# EasyEDA Pro project ProDoc_Small size safemrc_2025-09-04.epro, board PCB1_1
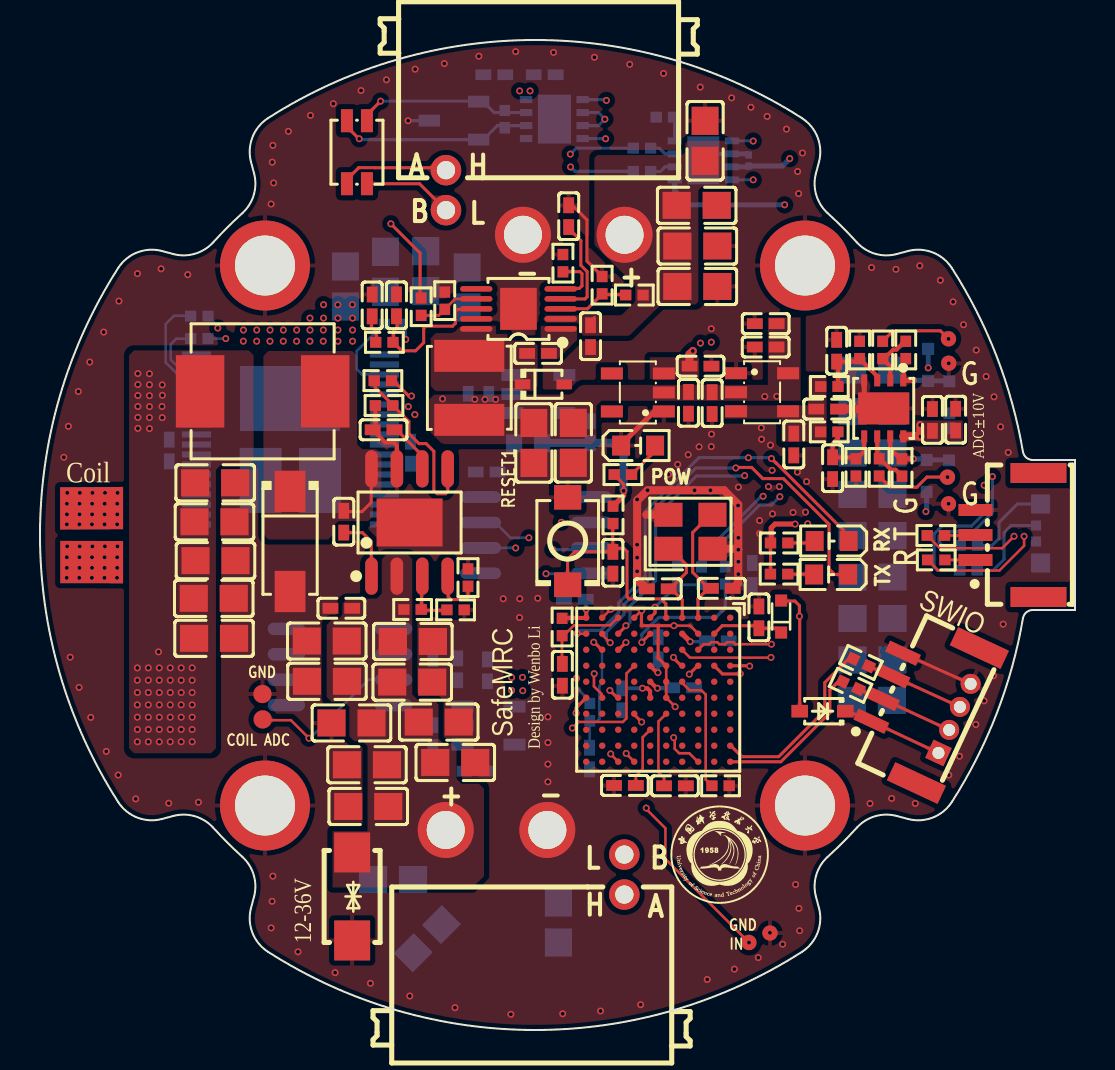
[diagram p4: board, top side]
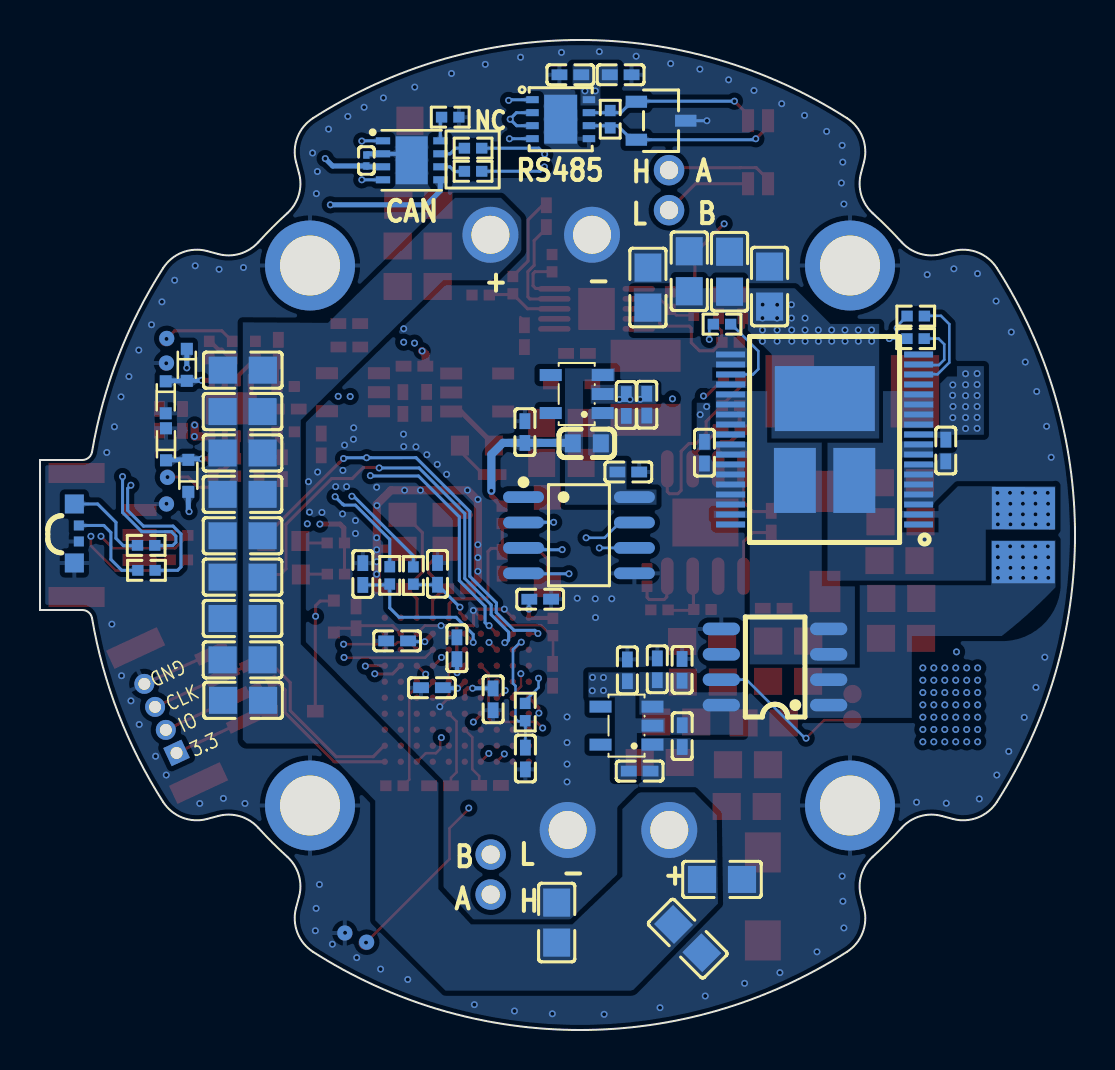
[diagram p5: board, bottom side, seen from below]

Outline 51.75 x 49.5 mm; copper layers: Top Layer, 地层1, Inner1, Inner2, 地层2, Bottom Layer. Coordinates in mm from the lower left corner of the outline.
Outline path: 3.91,38.09 arc(4.87,38.88) 6.11,38.95 6.66,38.8 arc(7.74,38.81) 8.66,39.38 arc(9.37,40.13) 10.12,40.84 arc(10.69,41.76) 10.7,42.84 10.55,43.39 arc(10.62,44.63) 11.41,45.6 arc(24.75,49.5) 38.09,45.6 arc(38.88,44.63) 38.95,43.39 38.8,42.84 arc(38.81,41.76) 39.38,40.84 arc(40.13,40.13) 40.84,39.38 arc(41.76,38.81) 42.84,38.8 43.39,38.95 arc(44.63,38.88) 45.6,38.09 arc(47.83,33.68) 49.15,28.92 arc(49.32,28.62) 49.64,28.5 51.75,28.5 51.75,21 49.64,21 arc(49.32,20.88) 49.15,20.58 arc(47.83,15.82) 45.6,11.41 arc(44.63,10.62) 43.39,10.55 42.84,10.7 arc(41.76,10.69) 40.84,10.12 arc(40.13,9.37) 39.38,8.66 arc(38.81,7.74) 38.8,6.66 38.95,6.11 arc(38.88,4.87) 38.09,3.91 arc(24.75,0) 11.41,3.91 arc(10.62,4.87) 10.55,6.11 10.7,6.66 arc(10.69,7.74) 10.12,8.66 arc(9.37,9.37) 8.66,10.12 arc(7.74,10.69) 6.66,10.7 6.11,10.55 arc(4.87,10.62) 3.91,11.41 arc(0,24.75) 3.91,38.09
Stack: Top Layer 0.035mm 外层铜厚1oz / Dielectric1 0.0994mm 3313 RC57% 4.2mil / 地层1 0.0152mm 内层铜厚 / 介电2 0.55mm 0.55mm H/H No copper / Inner1 0.0152mm 内层铜厚 / Dielectric3 0.1088mm 2116 RC54% 4.9mil / Inner2 0.0152mm 内层铜厚 / Dielectric4 0.55mm 0.55mm H/H No copper / 地层2 0.0152mm 内层铜厚 / Dielectric5 0.0994mm 3313 RC57% 4.2mil / Bottom Layer 0.035mm 外层铜厚1oz

## Design rules (mm)
template: JLCPCB Capability(Multiple Layers Board)
spacing copperThickness1oz (default): track to track 0.102, other pairs 0.152 to 0.3
spacing copperThickness2oz: track to track 0.203, other pairs 0.152 to 0.3
spacing copperThicknessInner0.5oz: track to track 0.089, other pairs 0.152 to 0.3
track width copperThickness1oz (default): min 0.102, default 0.254, max 2.54
track width copperThickness2oz: min 0.203, default 0.254, max 2.54
track width copperThickness0.5oz: min 0.089, default 0.254, max 2.54
differential pair differentialPair (default): width min 0.127, default 0.254, max 2.54; gap min 0.152, default 0.152
via viaSize (default): diameter min 0.3, default 0.61, max 10; hole min 0.2, default 0.305, max 6.3

## Placement (name value [footprint] x y rotation side)
C1  100nF  [C0402]  35.95 20.63 270 top
C2  100nF  [C0402]  30.9 19.09 270 bottom
C3  100nF  [C0402]  32.15 17.11 180 bottom
C4  100nF  [C0402]  26.74 21.54 0 bottom
C5  100nF  [C0402]  29.09 16.53 90 bottom
C6  100nF  [C0402]  33.89 19.46 180 bottom
C9  100nF  [C0402]  34.09 22.08 180 top
C10  100nF  [C0402]  28.64 23.36 90 top
C11  22pF  [C0402]  30.89 22.06 0 top
C12  100nF  [C0402]  22.33 27.9 0 bottom
C13  10uF  [C0603]  24.41 29.33 0 bottom
C14  2.2uF  [C0402]  31.75 12.21 180 top
C15  100nF  [C0402]  15.19 25.41 90 top
C24  100nF  [C0402]  15.07 21.09 180 top
C25  22nF  [C0402]  17.18 30.01 0 top
C37  100nF  [C0402]  25.23 47.76 180 bottom
C38  100nF  [C0402]  18.53 28.87 270 bottom
C39  100nF  [C0402]  6.46 28.98 270 bottom
C41  10nF  [C0402]  19.64 14.69 90 bottom
C45  100pF  [C0402]  27.48 13.57 90 bottom
C52  1uF  [C0402]  20.89 18.04 270 bottom
C53  100nF  [C0402]  21.77 12.94 0 bottom
C55  100nF  [C0402]  19.65 18.01 270 bottom
C56  1uF  [C0402]  22.38 17.98 270 bottom
C60  100nF  [C0402]  26.12 17.76 90 top
C61  2.2uF  [C0402]  29.25 12.23 180 top
C120  10uF  [C0805]  32.83 41.23 180 top
C132  47uF  [C0805]  24.69 29.35 90 top
C133  47uF  [C0805]  26.67 29.36 90 top
C141  10uF  [C0805]  32.87 39.2 180 top
C142  10uF  [C0805]  41.61 32.99 180 bottom
C143  10uF  [C0805]  16.35 13.26 0 top
C144  10uF  [C0805]  32.87 37.18 180 top
C145  10uF  [C0805]  18.61 17.39 180 top
C146  10uF  [C0805]  14.35 17.43 0 top
C147  10uF  [C0805]  15.57 15.35 0 top
C148  10uF  [C0805]  20.76 13.38 180 top
C149  10uF  [C0805]  18.64 19.43 180 top
C150  10uF  [C0805]  19.94 15.4 180 top
C151  10uF  [C0805]  41.62 30.92 180 bottom
C152  10uF  [C0805]  41.62 28.85 180 bottom
C153  10uF  [C0805]  41.62 24.71 180 bottom
C154  10uF  [C0805]  41.62 18.51 180 bottom
C155  10uF  [C0805]  17.65 7.53 0 bottom
C156  10uF  [C0805]  41.62 20.57 180 bottom
C157  10uF  [C0805]  41.62 26.78 180 bottom
C158  10uF  [C0805]  41.6 16.48 180 bottom
C159  10uF  [C0805]  16.41 11.18 0 top
C160  10uF  [C0805]  25.92 5.37 270 bottom
C161  10uF  [C0805]  41.62 22.64 180 bottom
C162  10uF  [C0805]  8.76 27.36 180 top
C163  10uF  [C0805]  17.27 37.92 270 bottom
C164  10uF  [C0805]  15.27 37.17 270 bottom
C165  10uF  [C0805]  8.69 21.58 180 top
C166  10uF  [C0805]  8.78 23.47 180 top
C167  10uF  [C0805]  8.7 19.58 180 top
C168  10uF  [C0805]  21.35 37.12 270 bottom
C169  10uF  [C0805]  19.29 37.94 270 bottom
C170  10uF  [C0805]  8.73 25.41 180 top
C171  220pF  [C0402]  26.43 40.69 270 top
C172  3.3nF  [C0402]  16.61 36.23 270 top
C173  22nF  [C0402]  17.82 36.24 270 top
C174  100nF  [C0402]  24.9 33.83 0 top
C175  100nF  [C0402]  27.53 34.69 270 top
C176  10uF  [C0805]  14.34 19.45 0 top
C177  1uF  [C0402]  33.03 33.19 180 top
C178  100nF  [C0402]  33.61 31.35 90 top
C179  1uF  [C0402]  32.42 31.36 90 top
C180  1uF  [C0402]  27.51 29.9 270 bottom
C181  100nF  [C0402]  22.44 31.25 90 bottom
C182  1uF  [C0402]  21.41 31.27 90 bottom
C183  10uF  [C0402]  22.72 47.76 180 bottom
C185  100nF  [C0201]  35.43 43.48 90 bottom
C186  1uF  [C0402]  37.69 29.28 90 top
C187  100nF  [C0402]  36.29 35.32 0 top
C188  1uF  [C0402]  36.28 34.15 0 top
C190  100nF  [C0402]  39.83 33.96 90 top
C191  100pF  [C0402]  35.61 22.8 270 bottom
C192  100nF  [C0402]  39.63 28.09 270 top
C193  100pF  [C0402]  31.87 22.81 270 bottom
C194  100nF  [C0402]  39.36 31.05 0 top
C195  100nF  [C0402]  44.62 30.5 270 top
C196  10uF  [C0402]  45.78 30.52 90 top
CN2  WAFER-GH1.25-3PWB  [CONN-TH_3P-P1.25_GH1.25]  48.35 24.75 90 top
D1  SS54  [sma_l4.4-w2.8-ls5.4-r-rd]  12.5 24.43 270 top
D3  SD103AWS  [SOD-323_L1.7-W1.3-LS2.6-RD-1]  39.13 15.94 180 top
D16  B5819WS  [SOD-323_L1.7-W1.3-LS2.5-FD]  25.17 32.28 180 top
D18  PESD1CAN  [SOT-23-3_L2.9-W1.6-P1.90-LS2.8-BR]  20.7 45.46 0 bottom
D20  SMAJ48CA  [SMA_L4.4-W2.8-LS5.1-BI]  15.61 6.68 90 top
D21  BZX584C3V3  [SOD-523_L1.2-W0.8-LS1.6-FD]  44.33 27.71 270 bottom
D22  BZX584C3V3  [SOD-523_L1.2-W0.8-LS1.6-FD]  45.45 29.28 270 bottom
D23  BZX584C3V3  [SOD-523_L1.2-W0.8-LS1.6-FD]  45.46 31.63 90 bottom
D24  BZX584C3V3  [SOD-523_L1.2-W0.8-LS1.6-FD]  44.41 33.26 90 bottom
EXTRA_ADC  -  [Test-Point-0.5mm]  35.45 4.37 0 top
L1  15uH  [IND-SMD_L7.0-W6.6_FXL0630]  11.13 31.93 0 top
L3  15uH  [IND-SMD_L4.0-W4.0]  21.47 32.11 270 top
L4  ACT1210-510-2P-TL00  [FILTER-SMD_4P-L3.2-W2.5-BL_ACT1210]  15.85 43.89 180 top
LED3  XL-3210SURUBC  [LED-SMD_4P-L3.2-W1.5_LED_RGB]  49.92 24.83 90 bottom
NOREF  -  [Pad_e2228]  36.5 4.85 0 top
NOREF#2  -  [Pad_e2523]  46 16.16 65 top
NOREF#3  -  [Pad_e4287]  45.38 27.63 0 top
NOREF#4  -  [Pad_e489]  2.58 26.09 0 top
NOREF#5  -  [Pad_e2518]  44.92 13.85 65 top
NOREF#6  -  [Pad_e4211]  45.44 33.34 0 top
NOREF#7  -  [Pad_e3956]  11.12 16.8 0 top
NOREF#8  -  [Pad_e4209]  35.42 4.39 0 top
NOREF#9  -  [Pad_e4265]  45.38 27.65 0 top
NOREF#10  -  [Pad_e94]  11.14 15.53 0 top
NOREF#11  -  [Pad_e4284]  45.41 34.58 0 top
NOREF#12  -  [Pad_e2524]  46.53 17.31 65 top
NOREF#13  -  [Pad_e2519]  45.46 15 65 top
NOREF#14  -  [Pad_e795]  2.58 23.39 0 top
NOREF#15  -  [Pad_e4285]  45.43 26.3 0 top
NOREF#16  -  [Pad_e4264]  45.43 26.31 0 top
NOREF#17  -  [Pad_e488]  2.58 23.4 0 top
NOREF#18  -  [Pad_e4286]  45.43 33.35 0 top
NOREF#19  -  [Pad_e4210]  45.43 34.55 0 top
NOREF#20  -  [Pad_e134]  2.58 26.09 0 top
NOREF#21  -  [Pad_e4207]  36.51 4.85 0 top
POW  NCD0603G1  [LED0603-RD_1]  29.9 29.22 0 top
R1  10kΩ  [R0402]  34.03 12.21 0 top
R3  10kΩ  [R0402]  28.65 25.76 90 top
R4  1kΩ  [R0402]  46.43 22.98 0 bottom
R5  1kΩ  [R0402]  46.44 24.23 0 bottom
R6  1kΩ  [R0402]  18.63 21.03 180 top
R7  11.5kΩ  [R0402]  21.4 22.62 270 top
R8  100kΩ  [R0402]  20.78 21.01 180 top
R9  10kΩ  [R0402]  17.2 31.22 0 top
R10  150kΩ  [R0402]  17.14 32.47 180 top
R17  100kΩ  [R0402]  29.14 27.77 180 top
R18  120Ω  [R0402]  23.24 45.54 90 bottom
R20  1kΩ  [R0402]  36.95 22.79 0 top
R21  1kΩ  [R0402]  36.96 24.35 0 top
R23  1kΩ  [R0402]  7.96 35.7 180 bottom
R25  1kΩ  [R0402]  7.97 34.57 180 bottom
R26  1kΩ  [R0402]  17.65 35.29 0 bottom
R33  120Ω  [R0402]  27.49 15.9 270 bottom
R36  100Ω  [R0402]  44.79 24.73 0 top
R37  100Ω  [R0402]  44.81 23.5 0 top
R38  100Ω  [R0402]  40.53 17.23 335 top
R39  100Ω  [R0402]  41.05 18.38 335 top
R40  10Ω  [R0402]  26.11 20.15 270 top
R143  200kΩ  [R0402]  26.15 38.34 270 top
R144  53.6kΩ  [R0402]  17.22 34.38 0 top
R150  180kΩ  [R0402]  29.72 36.75 0 top
R151  43kΩ  [R0402]  28.11 37.24 270 top
R152  10.2kΩ  [R0402]  20.24 36.47 270 top
R153  53.6kΩ  [R0402]  19.06 36.16 90 top
R156  0Ω  [R0402]  30.1 44.09 180 bottom
R157  0Ω  [R0402]  30.1 42.94 180 bottom
R158  0Ω  [R0402]  31.24 45.64 180 bottom
R167  33kΩ  [R0402]  43.29 34 270 top
R168  200kΩ  [R0402]  42.13 34 270 top
R170  10kΩ  [R0402]  40.98 34 90 top
R171  120Ω  [R0402]  34.26 22.73 270 bottom
R172  33kΩ  [R0402]  43.1 28.12 90 top
R173  200kΩ  [R0402]  41.96 28.13 90 top
R175  10kΩ  [R0402]  40.8 28.13 270 top
R176  120Ω  [R0402]  33.08 22.72 270 bottom
R177  13.3kΩ  [R0402]  39.46 29.91 180 top
R178  13.3kΩ  [R0402]  39.47 32.17 180 top
RESET1  TS-1088-AR02016  [SW-SMD_L3.9-W3.0-P4.45]  26.38 24.45 270 top
RX  NCD0603G1  [LED0603-RD_1]  39.58 24.45 180 top
TX  NCD0603G1  [LED0603-RD_1]  39.56 22.78 180 top
U2  B0520X  [SOD-523_L1.2-W0.8-LS1.6-FD]  37.06 20.67 270 top
U3  KTH7801-X-N-SOP8  [SOIC-8_L4.9-W3.9-P1.27-LS6.0-BL]  24.8 24.74 270 bottom
U4  LMR14050SDDA  [sop-8_l4.9-w3.9-p1.27-ls6.0-bl-ep-2]  18.48 25.37 0 top
U8  XT30PW(2+2)-M.G.B  [CONN-TH_4P-XT30PW-M]  24.76 41.38 180 top
U10  XT30PW(2+2)-M.G.B  [conn-th_4p-xt30pw-m]  24.75 8.39 0 top
U12  VNH7040AYTR  [POWERSSO-36_L10.3-W7.5-P0.50-LS10.3-BL-EP_VNH7070AYTR]  12.52 29.53 90 bottom
U14  CC6920BSO-5A  [SOP-8_L4.9-W3.9-P1.27-LS6.0-BL]  15 18.15 90 bottom
U16  TLV70433DBVR  [SOT-23-5_L3.0-W1.7-P0.95-LS2.8-BR]  22.42 15.22 180 bottom
U19  STM32H723VGH6  [TFBGA-100_L8.0-W8.0-R10-C10-P0.80-BL]  30.91 17.01 180 top
U49  SCT2620MRER  [MSOP-10_L3.0-W3.0-P0.50-LS5.0-BL-EP]  23.92 36.06 90 top
U50  2.2uF  [C0805]  19.37 4.57 45 bottom
U51  2.2uF  [C0805]  33.25 44.46 270 top
U52  TLV70433DBVR  [SOT-23-5_L3.0-W1.7-P0.95-LS2.8-BR]  29.89 31.88 0 top
U54  TLV70433DBVR  [SOT-23-5_L3.0-W1.7-P0.95-LS2.8-BR]  24.92 31.8 180 bottom
U55  -  [星月型焊盘]  11.25 11.22 0 top
U56  -  [星月型焊盘]  38.25 11.22 0 top
U57  -  [星月型焊盘]  11.25 38.22 0 top
U58  -  [星月型焊盘]  38.25 38.22 0 top
U59  MAX485EIDQ/TR  [DFN-8_L3.0-W3.0-P0.65-BL-EP2.45]  25.72 45.54 270 bottom
U60  TJA1051TK/3/1J  [HVSON-8_L3.0-W3.0-P0.65-BL-EP]  33.17 43.48 270 bottom
U61  WAFER-GH1.25-4PLB  [CONN-SMD_4P-P1.25_XUNPU_WAFER-GH1.25-4PLB]  43.88 16.43 65 top
U64  TLV70433DBVR  [SOT-23-5_L3.0-W1.7-P0.95-LS2.8-BR]  36.1 31.89 180 top
U66  LM358DQ3/TR  [DFN-8_L3.0-W3.0-P0.65-BL-EP-2]  42.19 31.08 180 top
X1  8MHz  [CRYSTAL-SMD_4P-L3.2-W2.5-BL]  32.52 24.91 0 top

## Footprints (pads in the part's own frame, mm; a bottom-side part is the same pattern mirrored in y, then rotated)
C0201
  rect 0.368x0.324 smd: 1(-0.275,0) 2(0.275,0)
C0402
  rect 0.79x0.54 smd: 1(-0.545,0) 2(0.545,0)
C0603
  rect 0.8x0.9 smd: 1(-0.7,0) 2(0.7,0)
C0805
  rect 1.41x1.35 smd: 1(-1,0) 2(1,0)
CONN-SMD_4P-P1.25_XUNPU_WAFER-GH1.25-4PLB
  rect 0.6x1.7 smd: 1(-1.875,1.675) 2(-0.625,1.675) 3(0.625,1.675) 4(1.875,1.675)
  rect 1x2.8 smd: 5(-3.725,-1.675) 6(3.725,-1.675)
CONN-TH_3P-P1.25_GH1.25
  rect 0.6x1.7 smd: 1(-1.25,1.575) 2(0,1.575) 3(1.25,1.575)
  rect 1x2.8 smd: 4(3.1,-1.575) 5(-3.1,-1.575)
conn-th_4p-xt30pw-m
  round 2.8 hole 1.9: 1(-4.465,1.615) 2(0.615,1.615)
  round 1.524 hole 0.914: 3(4.465,0.385) 4(4.465,-1.615)
CONN-TH_4P-XT30PW-M
  round 2.8 hole 1.9: 1(-4.465,1.615) 2(0.615,1.615)
  round 1.524 hole 0.914: 3(4.465,0.385) 4(4.465,-1.615)
CRYSTAL-SMD_4P-L3.2-W2.5-BL
  rect 1.4x1.2 smd: 1(-1.1,-0.85) 2(1.1,-0.85) 3(1.1,0.85) 4(-1.1,0.85)
DFN-8_L3.0-W3.0-P0.65-BL-EP2.45
  rect 0.35x0.625 smd: 1(-0.975,-1.413) 2(-0.325,-1.413) 3(0.325,-1.413) 4(0.975,-1.413) 5(0.975,1.413) 6(0.325,1.413) 7(-0.325,1.413) 8(-0.975,1.413)
  rect 2.45x1.65 smd: 9(0,0)
DFN-8_L3.0-W3.0-P0.65-BL-EP-2
  rect 0.3x0.6 smd: 1(-0.975,-1.4) 2(-0.325,-1.4) 3(0.325,-1.4) 4(0.975,-1.4) 5(0.975,1.4) 6(0.325,1.4) 7(-0.325,1.4) 8(-0.975,1.4)
  rect 2.56x1.6 smd: 9(0,0)
FILTER-SMD_4P-L3.2-W2.5-BL_ACT1210
  rect 0.6x1.15 smd: 1(-0.5,-1.575) 2(0.5,-1.575) 3(0.5,1.575) 4(-0.5,1.575)
HVSON-8_L3.0-W3.0-P0.65-BL-EP
  rect 0.355x0.711 smd: 1(-0.975,-1.433) 2(-0.325,-1.433) 3(0.325,-1.433) 4(0.975,-1.433) 5(0.975,1.433) 6(0.325,1.433) 7(-0.325,1.433) 8(-0.975,1.433)
  rect 2.4x1.6 smd: 9(0,0)
IND-SMD_L4.0-W4.0
  rect 1.6x3.5 smd: 1(-1.6,0) 2(1.6,0)
IND-SMD_L7.0-W6.6_FXL0630
  rect 2.424x3.62 smd: 1(3.128,0) 2(-3.128,0)
LED0603-RD_1
  rect 0.9x1 smd: 1(-0.85,0) 2(0.85,0)
LED-SMD_4P-L3.2-W1.5_LED_RGB
  rect 0.5x0.5 smd: 1(0.4,-0.113) 2(-0.4,-0.113)
  rect 0.95x0.95 smd: 3(1.475,0.113) 4(-1.475,0.113)
MSOP-10_L3.0-W3.0-P0.50-LS5.0-BL-EP
  oval 0.28x1.62 smd: 1(-1,-2.11) 2(-0.5,-2.11) 3(0,-2.11) 4(0.5,-2.11) 5(1,-2.11) 6(1,2.11) 7(0.5,2.11) 8(0,2.11) 9(-0.5,2.11) 10(-1,2.11)
  rect 2.1x1.83 smd: 11(0,0)
Pad_e94
  round 0.914 smd: TP2(0,0)
Pad_e134
  custom 0x0 smd far side: 102(0,0)
Pad_e488
  custom 0x0 smd: 102(0,0)
Pad_e489
  custom 0x0 smd: 102(0,0)
Pad_e795
  custom 0x0 smd far side: 102(0,0)
Pad_e2228
  round 0.762 smd: TP1(0,0)
Pad_e2518
  rect 1x1 hole 0.6: 2(0,0)
Pad_e2519
  round 1 hole 0.6: 3(0,0)
Pad_e2523
  round 1 hole 0.6: 4(0,0)
Pad_e2524
  round 1 hole 0.6: 5(0,0)
Pad_e3956
  round 0.914 smd: TP1(0,0)
Pad_e4207
  round 0.762 smd far side: TP1(0,0)
Pad_e4209
  round 0.762 smd far side: TP1(0,0)
Pad_e4210
  round 0.762 smd: TP1(0,0)
Pad_e4211
  round 0.762 smd: TP1(0,0)
Pad_e4264
  round 0.762 smd: TP1(0,0)
Pad_e4265
  round 0.762 smd: TP1(0,0)
Pad_e4284
  round 0.762 smd far side: TP1(0,0)
Pad_e4285
  round 0.762 smd far side: TP1(0,0)
Pad_e4286
  round 0.762 smd far side: TP1(0,0)
Pad_e4287
  round 0.762 smd far side: TP1(0,0)
POWERSSO-36_L10.3-W7.5-P0.50-LS10.3-BL-EP_VNH7070AYTR
  rect 0.3x1.45 smd: 1(-4.25,-4.7) 2(-3.75,-4.7) 3(-3.25,-4.7) 4(-2.75,-4.7) 5(-2.25,-4.7) 6(-1.75,-4.7) 7(-1.25,-4.7) 8(-0.75,-4.7) 9(-0.25,-4.7) 10(0.25,-4.7) 11(0.75,-4.7) 12(1.25,-4.7) 13(1.75,-4.7) 14(2.25,-4.7) 15(2.75,-4.7) 16(3.25,-4.7) 17(3.75,-4.7) 18(4.25,-4.7) 19(4.25,4.7) 20(3.75,4.7) 21(3.25,4.7) 22(2.75,4.7) 23(2.25,4.7) 24(1.75,4.7) 25(1.25,4.7) 26(0.75,4.7) 27(0.25,4.7) 28(-0.25,4.7) 29(-0.75,4.7) 30(-1.25,4.7) 31(-1.75,4.7) 32(-2.25,4.7) 33(-2.75,4.7) 34(-3.25,4.7) 35(-3.75,4.7) 36(-4.25,4.7)
  rect 3.25x5 smd: 37(2.046,-0.013)
  rect 3.25x2.1 smd: 38(-2.046,-1.486) 39(-2.046,1.486)
R0402
  rect 0.566x0.54 smd: 1(-0.433,0) 2(0.433,0)
SMA_L4.4-W2.8-LS5.1-BI
  rect 2x1.8 smd: 1(-2.2,0) 2(2.2,0)
sma_l4.4-w2.8-ls5.4-r-rd
  rect 2.062x1.539 smd: 1(2.503,0) 2(-2.503,0)
SOD-323_L1.7-W1.3-LS2.5-FD
  rect 0.78x0.5 smd: 1(-1.04,0) 2(1.04,0)
SOD-323_L1.7-W1.3-LS2.6-RD-1
  rect 0.83x0.63 smd: 1(-1.14,0) 2(1.14,0)
SOD-523_L1.2-W0.8-LS1.6-FD
  rect 0.6x0.6 smd: 1(-0.8,0) 2(0.8,0)
SOIC-8_L4.9-W3.9-P1.27-LS6.0-BL
  oval 0.588x2.045 smd: 1(-1.905,-2.772) 2(-0.635,-2.772) 3(0.635,-2.772) 4(1.905,-2.772) 5(1.905,2.772) 6(0.635,2.772) 7(-0.635,2.772) 8(-1.905,2.772)
SOP-8_L4.9-W3.9-P1.27-LS6.0-BL
  oval 0.63x1.865 smd: 1(-1.905,-2.683) 2(-0.635,-2.683) 3(0.635,-2.683) 4(1.905,-2.683) 5(1.905,2.683) 6(0.635,2.683) 7(-0.635,2.683) 8(-1.905,2.683)
sop-8_l4.9-w3.9-p1.27-ls6.0-bl-ep-2
  oval 0.63x1.865 smd: 1(-1.905,-2.683) 2(-0.635,-2.683) 3(0.635,-2.683) 4(1.905,-2.683) 5(1.905,2.683) 6(0.635,2.683) 7(-0.635,2.683) 8(-1.905,2.683)
  rect 3.3x2.4 smd: 9(0,0)
SOT-23-3_L2.9-W1.6-P1.90-LS2.8-BR
  rect 1.07x0.6 smd: 1(1.235,-0.95) 2(1.235,0.95) 3(-1.235,0)
SOT-23-5_L3.0-W1.7-P0.95-LS2.8-BR
  rect 1.1x0.6 smd: 1(1.3,-0.95) 2(1.3,0) 3(1.3,0.95) 4(-1.3,0.95) 5(-1.3,-0.95)
SW-SMD_L3.9-W3.0-P4.45
  rect 1.23x1.36 smd: 1(-2.185,0) 2(2.185,0)
Test-Point-0.5mm
  round 0.762 smd: 1(0,0)
TFBGA-100_L8.0-W8.0-R10-C10-P0.80-BL
  round 0.32 smd: A1(-3.6,-3.6) A2(-3.6,-2.8) A3(-3.6,-2) A4(-3.6,-1.2) A5(-3.6,-0.4) A6(-3.6,0.4) A7(-3.6,1.2) A8(-3.6,2) A9(-3.6,2.8) A10(-3.6,3.6) B1(-2.8,-3.6) B2(-2.8,-2.8) B3(-2.8,-2) B4(-2.8,-1.2) B5(-2.8,-0.4) B6(-2.8,0.4) B7(-2.8,1.2) B8(-2.8,2) B9(-2.8,2.8) B10(-2.8,3.6) C1(-2,-3.6) C2(-2,-2.8) C3(-2,-2) C4(-2,-1.2) C5(-2,-0.4) C6(-2,0.4) C7(-2,1.2) C8(-2,2) C9(-2,2.8) C10(-2,3.6) D1(-1.2,-3.6) D2(-1.2,-2.8) D3(-1.2,-2) D4(-1.2,-1.2) D5(-1.2,-0.4) D6(-1.2,0.4) D7(-1.2,1.2) D8(-1.2,2) D9(-1.2,2.8) D10(-1.2,3.6) E1(-0.4,-3.6) E2(-0.4,-2.8) E3(-0.4,-2) E4(-0.4,-1.2) E5(-0.4,-0.4) E6(-0.4,0.4) E7(-0.4,1.2) E8(-0.4,2) E9(-0.4,2.8) E10(-0.4,3.6) F1(0.4,-3.6) F2(0.4,-2.8) F3(0.4,-2) F4(0.4,-1.2) F5(0.4,-0.4) F6(0.4,0.4) F7(0.4,1.2) F8(0.4,2) F9(0.4,2.8) F10(0.4,3.6) G1(1.2,-3.6) G2(1.2,-2.8) G3(1.2,-2) G4(1.2,-1.2) G5(1.2,-0.4) G6(1.2,0.4) G7(1.2,1.2) G8(1.2,2) G9(1.2,2.8) G10(1.2,3.6) H1(2,-3.6) H2(2,-2.8) H3(2,-2) H4(2,-1.2) H5(2,-0.4) H6(2,0.4) H7(2,1.2) H8(2,2) H9(2,2.8) H10(2,3.6) J1(2.8,-3.6) J2(2.8,-2.8) J3(2.8,-2) J4(2.8,-1.2) J5(2.8,-0.4) J6(2.8,0.4) J7(2.8,1.2) J8(2.8,2) J9(2.8,2.8) J10(2.8,3.6) K1(3.6,-3.6) K2(3.6,-2.8) K3(3.6,-2) K4(3.6,-1.2) K5(3.6,-0.4) K6(3.6,0.4) K7(3.6,1.2) K8(3.6,2) K9(3.6,2.8) K10(3.6,3.6)
星月型焊盘
  round 4.5 hole 3x2.5: 1(0,0)

## Nets
As in the schematic, except:
GND: C1.1 C2.1 C3.1 C4.1 C5.1 C6.1 C9.1 C10.1 C11.1 C12.1 C13.1 C14.1 C24.2 C25.1 C37.1 C38.2 C39.2 C41.1 C45.1 C52.1 C53.1 C55.1 C56.1 C60.1 C61.2 C120.1 C132.1 C133.1 C141.1 C142.1 C143.1 C144.1 C145.1 C146.1 C147.1 C148.1 C149.1 C150.1 C151.1 C152.1 C153.1 C154.1 C155.1 C156.1 C157.1 C158.1 C159.1 C160.1 C161.1 C162.1 C163.1 C164.1 C165.1 C166.1 C167.1 C168.1 C169.1 C170.1 C171.1 C172.1 C173.1 C175.2 C176.1 C177.1 C178.1 C179.1 C180.1 C181.1 C182.1 C183.2 C185.2 C186.1 C187.1 C188.1 C190.2 C191.1 C192.2 C193.1 C194.2 C195.1 C196.2 CN2.3 D1.1 D16.1 D18.3 D20.1 D22.1 D23.1 LED3.2 LED3.4 NOREF.TP1 NOREF#6.TP1 NOREF#7.TP1 NOREF#12.5 NOREF#15.TP1 NOREF#16.TP1 NOREF#18.TP1 NOREF#21.TP1 POW.1 R1.2 R7.1 R8.1 R9.1 R143.1 R151.1 R152.1 R158.2 R170.2 R175.2 RESET1.1 U3.5 U4.7 U4.9 U8.2 U10.2 U12.3 U12.4 U12.5 U12.6 U12.7 U12.19 U12.20 U12.22 U12.30 U12.31 U12.32 U12.33 U12.34 U14.5 U16.1 U19.C2 U19.E4 U19.E5 U19.E6 U19.G1 U19.J1 U49.9 U49.11 U50.1 U51.1 U52.1 U54.1 U55.1 U56.1 U57.1 U58.1 U59.5 U59.9 U60.2 U60.9 U61.4 U64.1 U66.4 U66.9 X1.2 X1.4
EXTRA_ADC: EXTRA_ADC.1 NOREF#8.TP1 U19.G4
EXTRA_ADC_IN1: NOREF#11.TP1 NOREF#19.TP1 R168.1
EXTRA_ADC_IN2: NOREF#3.TP1 NOREF#9.TP1 R173.1
HSDA1: NOREF#4.102 NOREF#20.102 U12.2 U12.8 U12.9 U12.11 U12.12 U12.13 U12.14 U12.38
OUTB: NOREF#14.102 NOREF#17.102 U14.1 U14.2
V_BUS: D3.1 NOREF#5.2 U61.1
$1N12668: NOREF#13.3 R38.2 U61.2
$1N28774: NOREF#2.4 R39.2 U61.3
$3N5525: NOREF#10.TP2 R33.1 U14.7

Pads without a net: CN2 4 5; U3 1; U12 1 15 18 36; U14 6; U16 4 5; U19 A1 A2 A3 A5 A6 A7 A8 B1 B3 B5 B6 B7 B8 B9 B10 C5 C6 C7 C8 C9 D6 D7 D8 D9 D10 E2 E3 E8 E9 E10 F3 F7 F9 F10 G2 G3 G5 G6 G8 G9 H4 H5 H7 H8 H9 J4 J5 J7 J8 J9 J10 K3 K4 K5 K7 K8 K9 K10; U49 6; U52 4 5; U54 4 5; U61 5 6

## Via types
v1: diameter 0.35, hole 0.2, Top Layer to Bottom Layer, 344 vias

## Routing (per net, layer and track width the routed paths; a pad name or vN(x,y) marks a point on that pad's centre or on a via; arc(x,y) is an arc through that point)
5V: length 102.4
  Top Layer w0.152: v1(17.54,40.31) 19,38.85 19,36.63
  Top Layer w0.406: 44.02,29.68 44.03,29.68 ; 44.02,29.68 U66.8 ; 44.02,29.68 44.03,29.68 ; 44.02,29.68 44.02,29.69 v1(44.02,30.25)
  Inner1 w0.254: v1(37.49,43.57) 37.49,43.91 36.23,45.17 32.56,45.17 30.77,46.96 24.51,46.96
  Inner1 w0.406: v1(44.02,30.25) 38.28,30.25 v1(36.84,31.68) 36.83,31.68 v1(36.24,31.68) ; 20.16,31.53 v1(22.25,31.53) v1(22.78,31.53) ; 20.11,31.54 19.1,32.55 19.1,38.75 v1(17.54,40.31) 17.54,46.07 18.39,46.91 24.46,46.91 v1(24.5,46.96) ; v1(23.58,17.63) v1(23.58,16.98) 23.58,7.22 22.72,6.36 17.46,6.36 15.12,8.7 15.12,25.73 20.13,30.73 v1(20.13,31.56)
  Bottom Layer w0.254: 34.6,43.16 35.4,43.16 35.43,43.19 ; v1(37.49,43.57) 37.12,43.2 C185.1
  vias: v1(21.74,31.53) v1(23.98,46.96) v1(24.12,17.63) v1(24.14,16.97) v1(44.03,29.68)
12V: length 15.5
  Top Layer w0.152: v1(18.58,31.7) 18.44,31.7 17.62,32.52
  Inner1 w0.203: 14.06,32.98 15.87,31.17 v1(18.42,31.17) arc(18.65,31.03) v1(18.74,30.77)
  Inner2 w0.127: v1(15.63,35.6) 16.2,36.17 19.16,36.17 19.25,36.08 19.25,32.37 v1(18.58,31.7)
  vias: v1(4.9,32.82) v1(4.9,32.27) v1(4.9,31.73) v1(4.9,31.18) v1(4.9,30.63) v1(4.9,30.08) v1(4.87,18.11) v1(4.87,17.49) v1(4.87,16.87) v1(4.87,16.26) v1(4.87,15.64) v1(4.87,15.03) v1(4.87,14.41) v1(5.47,32.81) v1(5.47,32.26) v1(5.47,31.72) v1(5.47,31.17) v1(5.47,30.62) v1(5.47,30.07) v1(5.42,18.11) v1(5.42,17.49) v1(5.42,16.87) v1(5.42,16.26) v1(5.42,15.64) v1(5.42,15.03) v1(5.42,14.41) v1(5.93,18.91) v1(5.96,18.11) v1(5.96,17.49) v1(5.96,16.87) v1(5.96,16.26) v1(5.96,15.64) v1(5.96,15.03) v1(5.96,14.41) v1(6.11,32.26) v1(6.12,31.74) v1(6.1,31.18) v1(6.11,30.62) v1(6.51,18.11) v1(6.51,17.49) v1(6.51,16.87) v1(6.51,16.26) v1(6.51,15.64) v1(6.51,15.03) v1(6.51,14.41) v1(7.06,18.11) v1(7.06,17.49) v1(7.06,16.87) v1(7.06,16.26) v1(7.06,15.64) v1(7.06,15.03) v1(7.06,14.41) v1(7.61,18.11) v1(7.61,17.49) v1(7.61,16.87) v1(7.61,16.26) v1(7.61,15.64) v1(7.61,15.03) v1(7.61,14.41) v1(10.17,35) v1(10.17,34.44) v1(10.84,35) v1(10.83,34.44) v1(11.5,34.44) v1(11.5,35) v1(12.17,35) v1(12.16,34.44) v1(12.83,35) v1(12.83,34.44) v1(13.5,35.6) v1(13.5,34.44) v1(13.5,35) v1(14.18,36.27) v1(14.18,35.6) v1(14.17,35) v1(14.16,34.44) v1(14.89,36.26) v1(14.9,35.6) v1(14.9,35) v1(14.9,34.44) v1(15.62,36.27) v1(15.63,35) v1(15.63,34.44)
GND: length 49.6
  Top Layer w0.127: v1(28.53,21.04) 28.53,21.04 U19.J1 ; v1(31.76,16.16) 31.76,16.17 U19.E6 U19.E5 U19.E4 ; v1(31.7,20.22) 32.51,20.22 U19.C2 ; U19.G1 30.08,20.98
  Top Layer w0.152: 30.92,20.22 30.91,20.2 30.91,18.6 31.3,18.21 U19.E4 ; 30.92,20.22 v1(31.7,20.22) ; 30.92,20.22 30.07,20.22 30.07,20.97 v1(30.08,20.98) 30.02,21.04 v1(28.53,21.04) ; 26.61,41.24 27.35,40.5 27.35,38.45 28.02,37.78 28.03,37.78 ; 43.29,18.76 NOREF#12.5
  Top Layer w0.203: R9.1 16.77,30.14 C25.1 17.26,29.39 17.68,29.39 17.84,29.22 U4.7
  Top Layer w0.254: 41.74,31.08 41.21,31.61 U66.4 ; U52.1 30.71,30.93 29.05,29.27 POW.1
  Top Layer w0.406: 30.31,22.08 29.86,22.53 v1(29.86,22.93) v1(29.86,23.62) v1(29.86,24.27) 29.86,26.46 v1(30.38,26.99) v1(32.73,26.99) v1(33.52,26.99) 34.2,26.99 34.91,26.28 34.91,24.02 ; 34.91,24.02 34.87,24.06 X1.2 ; 34.91,24.02 34.91,22.36 34.65,22.1 34.67,22.08 ; 34.91,24.02 v1(34.92,24.01) ; C194.2 42.15,31.05 U66.9 ; X1.4 30.31,25.76
  Bottom Layer w0.152: D18.3 v1(18.4,45.46)
  Bottom Layer w0.203: U60.9 33.49,43.81 34.6,43.81
  Bottom Layer w0.254: 35.43,43.74 35.36,43.81 34.6,43.81
  vias: v1(1.19,28.64) v1(1.42,30.19) v1(1.51,18.64) v1(1.92,31.93) v1(1.95,17.13) v1(2.49,33.4) v1(2.54,15.63) v1(3.19,34.9) v1(3.31,13.93) v1(3.95,36.45) v1(3.91,12.75) v1(4.79,11.55) v1(4.87,37.82) v1(6.06,38.06) v1(6.44,11.34) v1(7.39,37.77) v1(7.92,11.39) v1(11.55,41.3) v1(11.55,5.1) v1(11.64,44.23) v1(11.61,43.39) v1(11.68,42.35) v1(11.64,7.69) v1(11.61,6.44) v1(12.42,44.93) v1(12.9,3.91) v1(13.52,45.73) v1(14.67,46.31) v1(14.76,2.87) v1(16.05,46.98) v1(16.52,2.33) v1(17.32,47.51) v1(18.49,1.7) v1(18.76,48.04) v1(20.22,48.32) v1(20.75,1.12) v1(21.94,48.69) v1(23.16,21.56) v1(23.54,0.79) v1(23.79,48.92) v1(23.99,21.56) v1(23.98,20.62) v1(24.89,21.59) v1(25.4,15.65) v1(25.4,14.37) v1(25.4,13.29) v1(25.4,12.41) v1(25.68,48.88) v1(26.13,0.81) v1(27.72,48.64) v1(28.03,0.95) v1(29.49,48.28) v1(29.86,26.53) v1(30.03,1.27) v1(31.18,47.83) v1(31.42,27.79) v1(31.89,28.28) v1(32.41,28.76) v1(32.95,29.16) v1(33.01,47.15) v1(33.36,2.53) v1(33.56,35.06) v1(33.58,29.79) v1(33.56,29.17) v1(34.58,46.61) v1(34.72,3.05) v1(34.92,27.14) v1(34.9,26.22) v1(34.92,24.61) v1(34.92,23.41) v1(34.92,22.79) v1(35.55,46.14) v1(35.98,25.47) v1(35.98,24.83) v1(35.91,3.62) v1(36.07,30.11) v1(36.08,29.54) v1(36.36,45.68) v1(36.42,27.17) v1(36.5,4.86) v1(36.52,29.25) v1(36.61,27.98) v1(36.62,25.8) v1(36.97,27.17) v1(37.13,4.29) v1(37.32,45.04) v1(37.65,25.88) v1(37.78,7.27) v1(37.88,42.92) v1(37.87,27.9) v1(37.93,41.82) v1(37.95,6.08) v1(37.98,4.96) v1(38.12,43.85) v1(38.28,25.89) v1(38.33,27.42) v1(41.58,38.12) v1(41.5,11.33) v1(42.58,11.58) v1(42.8,38.03) v1(43.76,11.33) v1(43.99,38.21) v1(45.02,37.49) v1(45.44,33.34) v1(45.43,26.31) v1(45.44,12.75) v1(45.65,36.41) v1(45.97,13.69) v1(46.18,35.27) v1(46.79,15.28) v1(46.81,34) v1(47.2,16.46) v1(47.31,32.67) v1(47.7,31.66) v1(47.67,17.71) v1(48.03,30.16) v1(48.16,20.29) v1(48.41,28.88)
VBAT: length 3.7
  Top Layer w0.152: U19.B2 34.11,20.22 35.82,20.22 C1.2 36.84,20.09 U2.2
VCC3.3: length 103.6
  Top Layer w0.152: U2.1 37.08,21.45 37.74,21.45 37.97,21.22 v1(37.97,20.69) 37.99,20.67 D3.2 ; 28.71,27.77 28.71,27.76 29.18,27.29 v1(29.18,26.96) ; R21.1 36.53,22.8 R20.1
  Top Layer w0.203: v1(30.87,17.09) 30.84,17.09 U19.F5 ; 26.23,20.6 27.3,20.6 U19.K1 27.31,21.03 v1(27.3,21.04) ; U19.F6 30.5,16.62 30.5,16.95 30.37,17.09 v1(30.12,17.09) ; U19.F4 30.86,17.87 v1(30.9,17.87)
  Top Layer w0.254: R3.2 29.18,26.72 v1(29.18,26.96) ; v1(37.76,25.3) 36.75,25.3 36.56,25.11 36.56,24.39 R21.1 ; U19.D2 v1(32.51,19.42)
  Top Layer w0.406: 32.47,33.3 32.47,33.78 v1(32.64,33.95)
  Inner1 w0.254: v1(37.97,20.69) 38.58,21.3 38.58,24.08 37.76,24.9 v1(37.76,25.3) ; v1(27.3,21.04) 27.29,21.04 25.92,19.67 25.92,17.85 27.39,16.38 29.41,16.38 v1(30.12,17.09) v1(30.87,17.09) 30.9,17.11 v1(30.9,17.87) 31.66,17.87 32.51,18.72 v1(32.51,19.42) ; 33.07,34.39 33.07,37.51 36.82,41.26 v1(37.23,41.26)
  Inner1 w0.406: v1(27.3,21.04) 27.3,25.08 v1(29.18,26.96) 32.64,30.42 v1(32.64,33.95) 33.02,34.33 v1(33.02,34.34) 33.07,34.39 v1(33.57,34.39) 33.6,34.43 34.76,34.43 35.41,33.78 43.77,33.78 44.56,33 44.56,26.14 43.72,25.31 v1(38.39,25.31) 38.37,25.3 v1(37.76,25.3)
  Bottom Layer w0.152: C4.2 27.3,21.52 v1(27.3,21.04) ; v1(32.51,19.42) 33.31,19.42 C6.2
  Bottom Layer w0.203: C5.2 29.1,17.09 30.12,17.09 v1(30.12,17.09) ; v1(30.9,17.87) 30.9,18.54 C2.2 ; v1(30.87,17.09) 31.42,17.09 31.48,17.03
  Bottom Layer w0.254: D21.2 44.33,25.96 v1(44.3,25.92) ; v1(37.23,41.26) 32.43,41.26 31.73,41.96 31.73,42.51 ; D24.2 v1(44.41,33.11)
  Bottom Layer w0.406: v1(29.18,26.96) 29.18,28.78 28.6,29.36 25.14,29.36 C13.2
A: length 59.2
  Top Layer w0.152: U8.4 19.71,42.99 19.59,43.11 16.75,43.11 16.74,43.12 15.95,43.12 15.95,43.11 15.94,43.11 15.46,42.64 15.46,42.43 L4.3
  Inner2 w0.152: U8.4 21.19,42.1 33.39,42.1 34.39,41.1 34.39,8.16 32.76,6.54 29.45,6.54 U10.4
ADC1: length 6.4
  Top Layer w0.152: v1(27.69,19.39) 27.71,19.39 28.08,19.01
  Bottom Layer w0.127: v1(27.69,19.39) 27.74,19.39 28.1,19.03 28.1,17.33 27.97,17.2 27.97,15.57 27.85,15.44 27.73,15.44 27.48,15.19 C45.2
ADC_IN10: length 8.4
  Top Layer w0.152: v1(30.09,19.38) 30.09,19.39 U19.F2
  Bottom Layer w0.152: v1(30.09,19.38) 30.09,19.78 30.41,20.09 30.41,20.12 30.54,20.26 30.57,20.26 30.95,20.64 33.79,20.64 34.26,21.11 34.26,22.35 34.36,22.25 C191.2
ADC_IN11: length 3.5
  Top Layer w0.152: U19.F1 30.75,20.86 v1(30.75,21.14)
  Bottom Layer w0.152: v1(30.75,21.14) 31.87,22.26 32.96,22.26 33.08,22.38
B: length 54.9
  Top Layer w0.152: L4.4 18.98,42.31 U8.3
  Inner2 w0.152: U10.3 29.48,8.51 31.62,8.51 34.02,10.91 34.02,14.53 34.13,14.65 34.13,21.83 34.02,21.94 34.02,40.72 32.9,41.84 21.15,41.84 U8.3
BATTERY: length 0.3
  Top Layer w0.102: 27.73,35.66 27.59,35.51 27.54,35.51
BOOT0: length 6.2
  Top Layer w0.127: U19.D5 32.11,17.35 32.47,16.99 33.07,16.99 33.29,16.77 33.29,12.52 R1.1
CANH-A: length 22.6
  Top Layer w0.152: L4.1 16.35,45.76 v1(17.03,46.44)
  Inner2 w0.152: v1(17.03,46.44) 21.54,46.44 24.18,43.79 v1(26.52,43.79)
  Bottom Layer w0.152: U59.7 22.71,45.87 22.16,46.41 D18.1 21.91,46.44 17.03,46.44 v1(17.03,46.44) ; R156.2 26.81,44.09 v1(26.52,43.79)
CANL-B: length 24.2
  Top Layer w0.152: v1(15.96,44.56) 15.95,44.56 15.4,45.11 15.4,45.41 L4.2
  Inner2 w0.152: v1(15.96,44.56) 22.36,44.56 23.77,43.15 v1(26.53,43.15)
  Bottom Layer w0.152: v1(26.53,43.15) 26.74,42.94 R157.2 ; U59.6 22.86,45.21 22.16,44.51 D18.2 16.01,44.51 v1(15.96,44.56)
EXTRA_ADC: length 21.8
  Top Layer w0.127: v1(26.62,15.1) 26.92,15.4 29.14,15.4 29.32,15.58 29.32,17.83 U19.G4 ; v1(35.45,4.37) 31.27,8.55 31.27,10.09 30.31,11.05 v1(30.31,11.1)
  Inner2 w0.127: v1(30.31,11.1) 30.31,14.31 29.56,15.06 26.66,15.06 v1(26.62,15.1)
EXTRA_ADC_IN1: length 3.7
  Top Layer w0.152: v1(45.43,34.55) 45.02,34.96 42.66,34.96 R168.1
EXTRA_ADC_IN2: length 3.9
  Top Layer w0.152: v1(45.38,27.65) 44.35,27.65 43.84,27.14 42.51,27.14 41.96,27.68 R173.1
FDCAN1_RX: length 28.2
  Top Layer w0.152: U19.B4 34.12,17.8 34.99,17.8 35,17.81 v1(35.01,17.81)
  Inner2 w0.152: v1(35.66,42.51) 35.41,42.26 35.41,29.2 35.87,28.73 35.87,27.66 35.32,27.11 35.32,19.97 34.64,19.29 34.64,18.18 v1(35.01,17.81)
  Bottom Layer w0.152: v1(35.66,42.51) 34.6,42.51
FDCAN1_TX: length 29.4
  Top Layer w0.152: v1(35.48,18.2) 35.46,18.21 U19.A4
  Inner2 w0.152: v1(35.66,44.45) 35.67,44.46 35.89,44.46 36.29,44.05 36.29,41.86 35.66,41.22 35.66,29.3 36.13,28.84 36.13,27.55 35.57,27 35.57,19.86 35.57,19.86 35.57,19.3 35.48,19.21 35.48,18.2 v1(35.48,18.2)
  Bottom Layer w0.152: 34.6,44.46 35.65,44.46 v1(35.66,44.45)
HSDA1:
  vias: v1(1.36,26.86) v1(1.35,26.31) v1(1.35,25.78) v1(1.34,25.28) v1(1.99,26.86) v1(1.98,26.31) v1(1.98,25.78) v1(1.97,25.28) v1(2.6,25.28) v1(2.62,26.86) v1(2.6,26.31) v1(2.6,25.78) v1(3.25,26.86) v1(3.23,26.31) v1(3.23,25.78) v1(3.23,25.28) v1(3.88,26.86) v1(3.86,26.31) v1(3.86,25.78) v1(3.86,25.28)
INA1: length 32.9
  Top Layer w0.152: 32.08,18.19 31.67,18.6 31.67,18.64
  Inner2 w0.152: v1(8.89,35.1) 8.88,35.09 8.88,31.89 22.07,18.71 31.59,18.71 31.68,18.61
  Bottom Layer w0.127: R23.1 8.89,35.2 v1(8.89,35.1)
  vias: v1(31.68,18.63)
INB1: length 31.4
  Top Layer w0.152: 32.9,18.23 32.47,17.8 v1(32.47,17.79)
  Inner2 w0.152: v1(32.47,17.79) 32.47,17.87 32.45,17.89 32.45,18.7 31.37,19.78 27.86,19.78 27.85,19.79 27.52,19.79 27.28,19.56 27.28,19.55 27.07,19.34 22.72,19.34 16.34,25.72 16.34,32.48 18.29,34.43 v1(18.29,34.53)
  Bottom Layer w0.127: v1(18.29,34.53) 18.29,35.09 R26.2
LED1: length 28.3
  Top Layer w0.127: v1(36.57,19.29) 34.77,19.29 34.67,19.39 34.36,19.39 34.26,19.29 33.97,19.29 33.87,19.39 33.56,19.39 33.46,19.29 33.19,19.29 U19.C3
  Inner2 w0.152: v1(47.21,27.24) 47.38,27.07 47.38,25.51 47.07,25.2 40.38,25.2 39.04,23.85 39.04,21.01 37.32,19.29 v1(36.57,19.29)
  Bottom Layer w0.152: v1(47.21,27.24) 47.37,27.08 47.37,25.99 46.58,25.19 45.1,25.19 44.7,24.8 44.7,23.15 44.87,22.98 R4.1
LED2: length 28.8
  Top Layer w0.127: v1(36.55,18.63) 36.45,18.63 36.43,18.62 32.5,18.62 32.11,19 U19.D3
  Inner2 w0.127: v1(47.62,27.67) 47.62,25.41 47.17,24.95 40.48,24.95 39.31,23.79 39.31,20.94 37,18.63 v1(36.55,18.63)
  Bottom Layer w0.152: v1(47.62,27.67) 47.62,25.88 46.66,24.92 45.18,24.92 44.96,24.7 44.96,24.38 45.11,24.22 46,24.22 R5.1
M_CMD_RX: length 44.8
  Top Layer w0.127: v1(26.85,19.83) 26.87,19.81 U19.K2
  Top Layer w0.152: RX.1 40.17,24.72 40.17,24.99 36.8,28.36 36.79,28.36 v1(36.57,28.57)
  Inner2 w0.152: v1(28.32,46.48) 29,45.79 30.77,45.79 35.15,41.41 35.15,28.88 v1(35.42,28.61)
  Bottom Layer w0.152: U59.1 28.28,46.51 v1(28.32,46.48) ; v1(36.57,28.57) 36.53,28.61 v1(35.42,28.61) 32.95,28.62 30.26,25.93 30.26,22.68 28.93,21.35 28.93,21.22 28.94,21.21 28.94,20.87 28.05,19.98 27.01,19.98 26.85,19.83 v1(26.85,19.83)
M_CMD_TX: length 45.1
  Top Layer w0.127: v1(28.51,19.37) 28.11,19.76 U19.J2
  Top Layer w0.152: v1(34.79,28.1) 34.82,28.13 35.58,28.13 36.14,27.57 37.17,27.57 39.45,25.29 39.45,23.05 39.73,22.78 TX.1
  Inner2 w0.152: v1(34.79,28.1) 34.64,28.25 34.64,41.2 30.56,45.29 29,45.29 v1(28.28,44.56)
  Bottom Layer w0.152: v1(34.79,28.1) 32.79,28.1 30.51,25.82 30.51,22.58 29.19,21.26 29.19,20.77 28.32,19.9 28.32,19.49 28.45,19.37 v1(28.51,19.37) ; v1(28.28,44.56) 28.28,44.57 U59.4
OSC_IN: length 6.3
  Top Layer w0.152: 32.9,20.61 32.9,21.56 33.4,22.06 33.46,22.06 ; 32.87,20.58 32.91,20.62 ; 33.46,22.06 32.63,22.89 32.63,24.87 33.54,25.78 33.54,25.79 ; 33.46,22.06 33.49,22.06
OSC_OUT: length 4.5
  Top Layer w0.152: 31.39,23.97 31.62,23.97 32.32,23.27 32.32,22.87 31.51,22.06 ; 32.11,20.59 32.11,21.51 31.56,22.06 31.49,22.06
OUTB:
  vias: v1(1.36,24.18) v1(1.34,23.64) v1(1.34,23.11) v1(1.33,22.61) v1(1.99,24.18) v1(1.97,23.64) v1(1.97,23.11) v1(1.96,22.61) v1(2.6,23.64) v1(2.6,23.11) v1(2.59,22.61) v1(2.62,24.18) v1(3.25,24.18) v1(3.23,23.64) v1(3.23,23.11) v1(3.22,22.61) v1(3.87,24.18) v1(3.86,23.64) v1(3.86,23.11) v1(3.85,22.61)
PWM2_CH1: length 29.7
  Top Layer w0.152: 28.88,18.96 28.87,18.96 29.25,19.34
  Inner2 w0.152: v1(9.29,34.57) 9.29,31.85 22.17,18.96 28.82,18.96 29.29,19.43
  Bottom Layer w0.127: v1(9.29,34.57) 8.41,34.57
  vias: v1(29.3,19.38)
PWM_CAP: length 26.4
  Top Layer w0.127: v1(31.68,14.62) 31.74,14.57 31.74,14.06 31.96,13.84 32.46,13.84 32.89,13.41 U19.C10
  Inner2 w0.127: v1(23.79,24.1) 23.8,24.11 23.8,24.95 25.16,26.31 29.31,26.31 33.89,21.73 33.89,14.75 33.77,14.62 v1(31.68,14.62)
  Bottom Layer w0.127: v1(23.79,24.1) 23.78,24.11 U3.6
RESET: length 10.9
  Top Layer w0.152: 28.62,23.92 26.75,23.92 26.38,23.55 26.38,22.28 26.36,22.27 ; 28.64,23.96 28.64,25.39 ; 28.73,23.92 28.9,24.08 29.19,24.08 29.35,23.93 29.35,21.66 29.46,21.56 31.04,21.56 31.29,21.31 31.29,20.61
SPI4_MISO: length 23.6
  Top Layer w0.152: v1(26.81,15.85) 26.81,16.11 27.29,16.6
  Inner2 w0.152: v1(26.81,15.85) 26.85,15.8 30.25,15.8 30.76,15.29 31.92,15.29 33.4,16.77 33.4,20.74 31.82,22.31 25.8,22.31 v1(25.3,22.81)
  Bottom Layer w0.152: 27.62,22.82 27.61,22.81 v1(25.3,22.81)
SPI4_MOSI: length 20.8
  Top Layer w0.152: 29.69,15.81 29.69,15.79 v1(30.08,15.4)
  Inner2 w0.152: v1(26.07,25.39) 26.07,25.39 26.57,25.89 29.13,25.89 33.65,21.36 33.65,16.66 32.01,15.02 30.46,15.02 v1(30.08,15.4)
  Bottom Layer w0.152: v1(26.07,25.39) 27.52,25.39 27.54,25.37
SPI4_NSS: length 21.9
  Top Layer w0.152: 28.92,16.59 28.89,16.59 28.51,16.97
  Inner2 w0.152: v1(28.49,16.98) 28.78,16.69 32.29,16.69 32.91,17.31 32.91,20.54 31.63,21.82 25.32,21.82 24.65,22.49 24.65,23.35 25.31,24.02 v1(25.64,24.02)
  Bottom Layer w0.152: 27.69,24.01 25.65,24.01 v1(25.64,24.02)
SPI4_SCK: length 28.9
  Top Layer w0.127: v1(27.71,17.82) 27.7,17.81 27.7,17.18 28.07,16.81 28.07,16.65 U19.J6
  Inner2 w0.127: v1(27.71,17.82) 27.71,16.33 27.99,16.04 30.35,16.04 30.77,15.62 31.91,15.62 33.15,16.87 33.15,20.64 31.73,22.06 25.42,22.06 24.89,22.59 24.89,22.95 25.14,23.2 25.64,23.2 26.11,23.67 26.11,24.1 25.6,24.61 v1(24.45,24.61)
  Bottom Layer w0.127: U3.7 22.76,25.38 23.52,24.61 v1(24.45,24.61)
SWDCLK: length 9.1
  Top Layer w0.152: 40.53,18.51 40.38,18.51 39.24,17.37 39.24,15.97 36.94,13.67 35.09,13.67 34.5,14.25
SWDIO: length 7.9
  Top Layer w0.152: 40.12,17.4 40.11,17.39 39.89,17.39 39.49,17 39.49,15.87 37.04,13.41 34.53,13.41 34.52,13.42
USART1_RX: length 53
  Top Layer w0.127: R37.1 44.39,23.5 44.92,22.97 47.97,22.97 49.2,24.21 v1(49.2,24.69) ; v1(29.31,13.83) 29.31,13.82 U19.G10
  Inner2 w0.127: v1(29.31,13.83) 27.96,12.48 27.96,6.44 28.81,5.6 34.7,5.6 36.24,7.14 36.24,8.67 35.38,9.53 35.38,16.69 39.55,20.85 39.55,23.7 40.57,24.73 48.1,24.73 48.45,25.08 49,25.08 49.2,24.87 v1(49.2,24.69)
USART1_TX: length 51.8
  Top Layer w0.127: v1(28.53,13.8) 28.53,13.79 U19.H10 ; v1(48.7,24.69) 48.11,24.09 45,24.09 R36.1
  Inner2 w0.127: v1(28.53,13.8) 28.64,13.69 28.64,13.51 27.53,12.4 27.53,6.09 28.5,5.11 34.59,5.11 36.58,7.1 36.58,8.9 35.72,9.76 35.72,16.7 39.77,20.76 39.77,23.55 40.72,24.5 48.48,24.5 48.67,24.69 v1(48.7,24.69)
USART2_DE: length 36.6
  Top Layer w0.152: U19.H2 29.3,20.2 v1(29.3,20.22)
  Inner2 w0.152: v1(28.24,45.54) 30.66,45.54 34.9,41.31 34.9,28.57 35.23,28.23 v1(35.23,27.72)
  Bottom Layer w0.152: U59.2 27.93,45.87 28.24,45.55 v1(28.24,45.54) 27.92,45.21 U59.3 ; v1(29.3,20.22) 29.34,20.22 29.5,20.37 29.5,21.19 30.78,22.47 30.78,25.66 32.82,27.7 35.21,27.7 v1(35.23,27.72)
V_BUS: length 4.8
  Top Layer w0.152: 41.71,15.36 NOREF#5.2 ; 41.66,15.36 40.49,15.9
$1N1609: length 4.7
  Bottom Layer w0.152: 46.86,22.98 47.66,22.98 48.21,23.53 48.21,24.88 48.56,25.23 LED3.1
$1N5066: length 4.5
  Bottom Layer w0.152: LED3.3 48.87,26.3 47.95,25.38 47.95,24.58 47.58,24.22 46.89,24.22 R5.2
$1N12483: length 1.6
  Top Layer w0.127: R36.2 46.81,24.73 46.84,24.75
$1N12668: length 5.2
  Top Layer w0.152: NOREF#13.3 42.39,16.42 40.89,17.06
  Top Layer w0.406: 42.23,16.5 42.39,16.42
$1N20786: length 4.2
  Top Layer w0.127: 28.88,20.61 28.51,20.23 26.7,20.23 26.18,19.72 ; 26.1,18.49 26.1,19.62 26.1,19.63
$1N20952: length 3.1
  Top Layer w0.127: C61.1 29.79,12.7 30.14,13.04 30.14,14.64 U19.F8
$1N21004: length 3.9
  Top Layer w0.127: U19.E7 30.92,15.43 30.92,12.89 31.2,12.61 C14.2
$1N22551: length 1.6
  Top Layer w0.127: 46.84,23.5 46.83,23.5 R37.2
$1N28774: length 5.1
  Top Layer w0.152: 41.43,18.2 42.83,17.55 ; 42.76,17.63 NOREF#2.4
$2N2387: length 3.3
  Top Layer w0.152: 15.21,24.87 16.12,24.87 16.57,24.42 16.57,22.66 16.55,22.64
$2N2389: length 2.6
  Top Layer w0.152: 19.08,28.03 19.11,28.06 19.11,28.63 19.06,28.67 19.06,28.78 17.93,29.91 17.71,29.91
$2N2390: length 2.6
  Top Layer w0.152: 20.41,22.64 20.41,21.66 20.54,21.52 21.29,21.52 21.4,21.63 21.4,22.15 21.4,22.16
$2N2393: length 3
  Top Layer w0.152: 19.04,20.99 19.06,20.98 20.29,20.98 ; 19.01,22.77 19.08,22.7 19.08,21.04
$2N2394: length 3.4
  Top Layer w0.152: 16.34,28.14 16.56,27.92 16.56,26.38 16.1,25.92 15.41,25.92 15.28,26.05
$2N2395: length 8.9
  Top Layer w0.152: 17.64,31.21 17.66,31.21 18.44,30.43 18.44,29.82 18.95,29.32 19.31,29.32 19.69,28.93 19.69,26.98 19.86,26.81 20.28,26.81 20.39,26.92 20.39,28.06 ; 16.75,32.5 16.75,32.14 17.47,31.42 17.47,31.17
